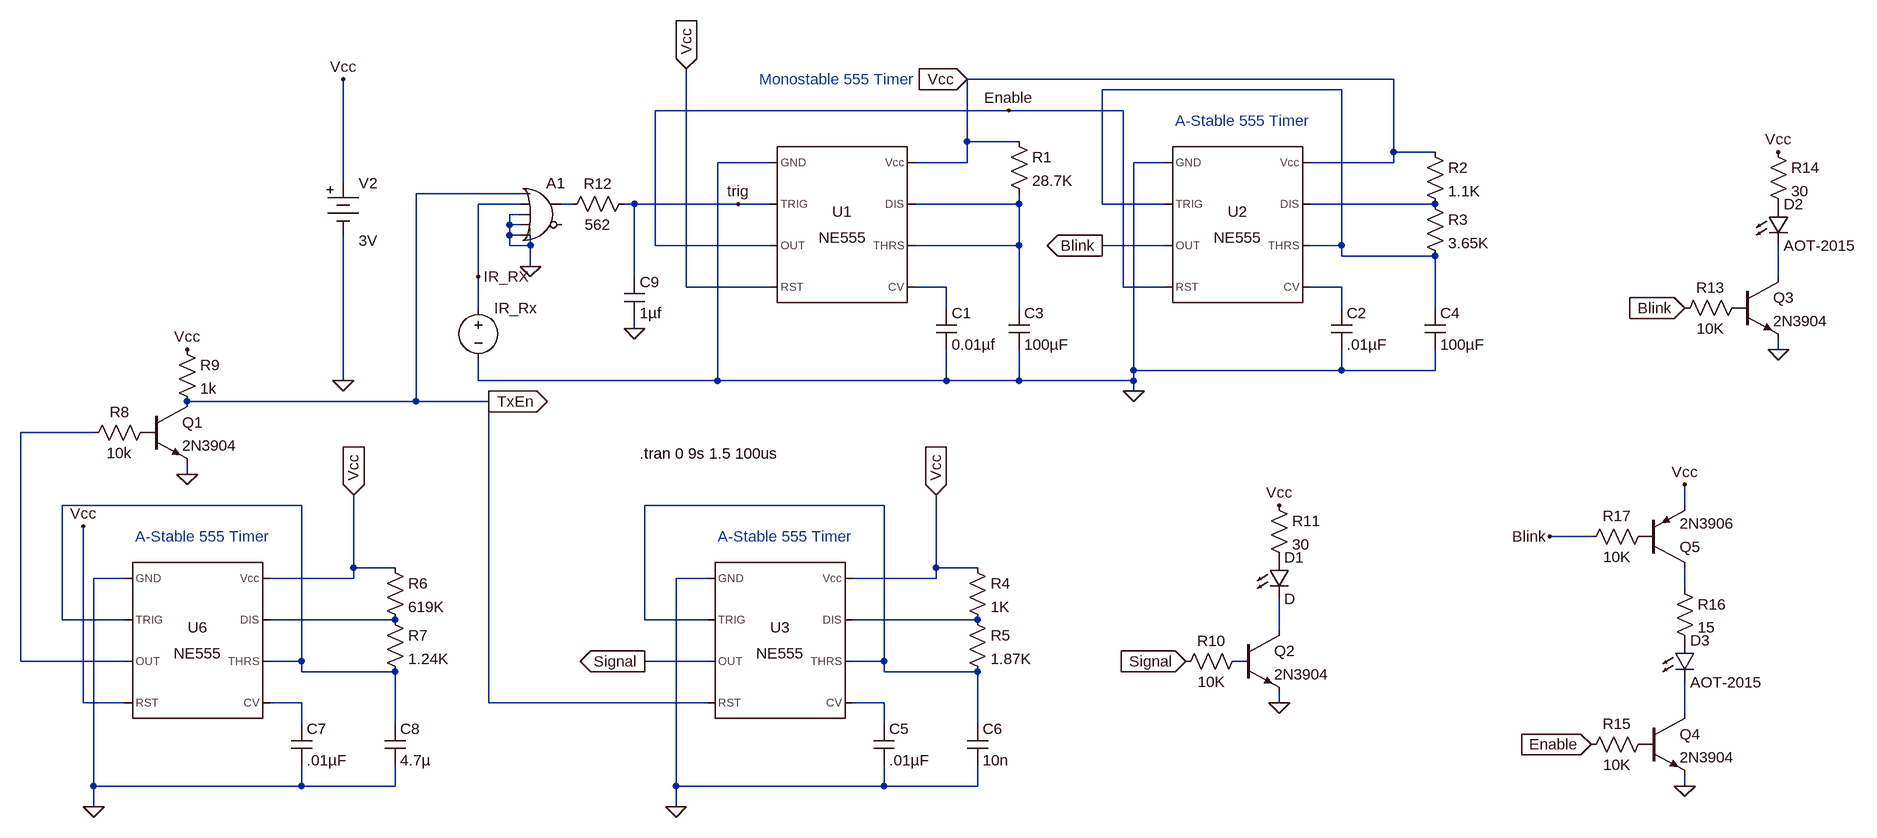
[diagram p0: schematic 555TimerPlanChris.asc]
555TimerPlanChris.asc, the LTspice schematic file:
Version 4
SHEET 1 1900 1200
WIRE 1184 64 528 64
WIRE 1104 80 736 80
WIRE 592 112 48 112
WIRE 768 112 592 112
WIRE 528 160 528 64
WIRE 608 160 528 160
WIRE 1184 176 1184 64
WIRE 1248 176 1184 176
WIRE 224 192 144 192
WIRE 528 192 528 160
WIRE 528 192 448 192
WIRE 832 192 784 192
WIRE 1184 192 1184 176
WIRE 1184 192 1056 192
WIRE -432 224 -432 64
WIRE -160 240 -320 240
WIRE -160 256 -224 256
WIRE -80 256 -96 256
WIRE 16 256 0 256
WIRE 176 256 16 256
WIRE 224 256 176 256
WIRE 608 256 608 240
WIRE 608 256 448 256
WIRE 736 256 736 80
WIRE 832 256 736 256
WIRE 1248 256 1056 256
WIRE -160 272 -176 272
WIRE -176 288 -176 272
WIRE -160 288 -176 288
WIRE -176 304 -176 288
WIRE -160 304 -176 304
WIRE -176 320 -176 304
WIRE -144 320 -144 304
WIRE -144 320 -176 320
WIRE 48 320 48 112
WIRE 224 320 48 320
WIRE 608 320 608 256
WIRE 608 320 448 320
WIRE 832 320 736 320
WIRE 1104 320 1104 80
WIRE 1104 320 1056 320
WIRE 1104 336 1104 320
WIRE 1248 336 1104 336
WIRE -144 352 -144 320
WIRE -224 368 -224 256
WIRE 16 368 16 256
WIRE 1776 368 1776 320
WIRE 96 384 96 48
WIRE 224 384 96 384
WIRE 496 384 448 384
WIRE 768 384 768 112
WIRE 832 384 768 384
WIRE 1104 384 1056 384
WIRE -224 416 -224 368
WIRE 496 416 496 384
WIRE 608 416 608 320
WIRE 1104 416 1104 384
WIRE 1248 416 1248 336
WIRE 16 448 16 432
WIRE 1776 480 1776 464
WIRE 784 512 784 192
WIRE 1104 512 1104 480
WIRE 1104 512 784 512
WIRE 1248 512 1248 480
WIRE 1248 512 1104 512
WIRE -432 528 -432 304
WIRE -224 528 -224 496
WIRE 144 528 144 192
WIRE 144 528 -224 528
WIRE 496 528 496 480
WIRE 496 528 144 528
WIRE 608 528 608 480
WIRE 608 528 496 528
WIRE 784 528 784 512
WIRE 784 528 608 528
WIRE 784 544 784 528
WIRE -320 560 -320 240
WIRE -320 560 -672 560
WIRE -208 560 -320 560
WIRE -816 608 -928 608
WIRE -672 672 -672 656
WIRE -496 720 -864 720
WIRE 400 720 32 720
WIRE 1632 720 1632 688
WIRE 1488 768 1424 768
WIRE -416 816 -416 704
WIRE -352 816 -416 816
WIRE 480 816 480 704
WIRE 544 816 480 816
WIRE -768 832 -816 832
WIRE -416 832 -416 816
WIRE -416 832 -544 832
WIRE 128 832 80 832
WIRE 480 832 480 816
WIRE 480 832 352 832
WIRE 1632 848 1632 816
WIRE -864 896 -864 720
WIRE -768 896 -864 896
WIRE -352 896 -544 896
WIRE 32 896 32 720
WIRE 128 896 32 896
WIRE 544 896 352 896
WIRE 1008 912 1008 864
WIRE -928 960 -928 608
WIRE -768 960 -928 960
WIRE -496 960 -496 720
WIRE -496 960 -544 960
WIRE 128 960 32 960
WIRE 400 960 400 720
WIRE 400 960 352 960
WIRE -496 976 -496 960
WIRE -352 976 -496 976
WIRE 400 976 400 960
WIRE 544 976 400 976
WIRE -832 1024 -832 752
WIRE -768 1024 -832 1024
WIRE -496 1024 -544 1024
WIRE -208 1024 -208 560
WIRE 128 1024 -208 1024
WIRE 400 1024 352 1024
WIRE 1008 1024 1008 1008
WIRE 1632 1040 1632 992
WIRE -496 1056 -496 1024
WIRE -352 1056 -352 976
WIRE 400 1056 400 1024
WIRE 544 1056 544 976
WIRE -816 1152 -816 832
WIRE -496 1152 -496 1120
WIRE -496 1152 -816 1152
WIRE -352 1152 -352 1120
WIRE -352 1152 -496 1152
WIRE 80 1152 80 832
WIRE 400 1152 400 1120
WIRE 400 1152 80 1152
WIRE 544 1152 544 1120
WIRE 544 1152 400 1152
WIRE 1632 1152 1632 1136
WIRE -816 1184 -816 1152
WIRE 80 1184 80 1152
FLAG 528 64 Vcc
IOPIN 528 64 In
FLAG 784 544 0
FLAG -432 528 0
FLAG -432 64 Vcc
FLAG 736 320 Blink
IOPIN 736 320 Out
FLAG 80 1184 0
FLAG 32 960 Signal
IOPIN 32 960 Out
FLAG -816 1184 0
FLAG -832 752 Vcc
FLAG 480 704 Vcc
IOPIN 480 704 In
FLAG -416 704 Vcc
IOPIN -416 704 In
FLAG -672 672 0
FLAG -672 480 Vcc
FLAG 1008 1024 0
FLAG 1008 720 Vcc
FLAG 864 960 Signal
IOPIN 864 960 In
FLAG -208 560 TxEn
IOPIN -208 560 Out
FLAG 96 48 Vcc
IOPIN 96 48 In
FLAG -144 352 0
FLAG -224 368 IR_RX
FLAG 16 448 0
FLAG 176 256 trig
FLAG 1776 480 0
FLAG 1776 176 Vcc
FLAG 1632 416 Blink
IOPIN 1632 416 In
FLAG 1632 1152 0
FLAG 1488 1088 Enable
IOPIN 1488 1088 In
FLAG 592 112 Enable
FLAG 1632 688 Vcc
FLAG 1424 768 Blink
SYMBOL Misc/NE555 336 288 R0
SYMATTR InstName U1
SYMBOL Misc/NE555 944 288 R0
SYMATTR InstName U2
SYMBOL cap 480 416 R0
SYMATTR InstName C1
SYMATTR Value 0.01µf
SYMBOL cap 1088 416 R0
SYMATTR InstName C2
SYMATTR Value .01µF
SYMBOL cap 592 416 R0
SYMATTR InstName C3
SYMATTR Value 100µF
SYMBOL res 592 144 R0
WINDOW 0 36 40 Left 2
WINDOW 3 36 76 Left 2
SYMATTR InstName R1
SYMATTR Value 28.7K
SYMBOL res 1232 160 R0
WINDOW 0 36 40 Left 2
WINDOW 3 36 76 Left 2
SYMATTR InstName R2
SYMATTR Value 1.1K
SYMBOL res 1232 240 R0
WINDOW 0 36 40 Left 2
WINDOW 3 36 76 Left 2
SYMATTR InstName R3
SYMATTR Value 3.65K
SYMBOL cap 1232 416 R0
SYMATTR InstName C4
SYMATTR Value 100µF
SYMBOL voltage -224 400 R0
WINDOW 3 24 96 Invisible 2
SYMATTR Value PULSE(3 0 2.03673 10us 10us 4ms 2.04073 3)
SYMATTR InstName IR_Rx
SYMBOL Misc/battery -432 208 R0
WINDOW 0 24 16 Left 2
WINDOW 3 24 104 Left 2
SYMATTR InstName V2
SYMATTR Value 3V
SYMBOL Misc/NE555 240 928 R0
SYMATTR InstName U3
SYMBOL cap 384 1056 R0
SYMATTR InstName C5
SYMATTR Value .01µF
SYMBOL res 528 800 R0
WINDOW 0 36 40 Left 2
WINDOW 3 36 76 Left 2
SYMATTR InstName R4
SYMATTR Value 1K
SYMBOL res 528 880 R0
WINDOW 0 36 40 Left 2
WINDOW 3 36 76 Left 2
SYMATTR InstName R5
SYMATTR Value 1.87K
SYMBOL cap 528 1056 R0
SYMATTR InstName C6
SYMATTR Value 10n
SYMATTR SpiceLine Rser=32.3m Lser=0 mfg="KEMET" pn="C0201C103K9PAC" type="X5R"
SYMBOL Misc/NE555 -656 928 R0
SYMATTR InstName U6
SYMBOL cap -512 1056 R0
SYMATTR InstName C7
SYMATTR Value .01µF
SYMBOL res -368 800 R0
WINDOW 0 36 40 Left 2
WINDOW 3 36 76 Left 2
SYMATTR InstName R6
SYMATTR Value 619K
SYMBOL res -368 880 R0
WINDOW 0 36 40 Left 2
WINDOW 3 36 76 Left 2
SYMATTR InstName R7
SYMATTR Value 1.24K
SYMBOL cap -368 1056 R0
SYMATTR InstName C8
SYMATTR Value 4.7µ
SYMATTR SpiceLine V=X Rser=3m Lser=0 mfg="TDK" pn="C2012X5ROJ475M" type="X5R"
SYMBOL res -720 592 R90
WINDOW 0 0 56 VBottom 2
WINDOW 3 32 56 VTop 2
SYMATTR InstName R8
SYMATTR Value 10k
SYMBOL npn -736 560 R0
WINDOW 0 56 32 Left 2
WINDOW 3 56 68 Left 2
SYMATTR InstName Q1
SYMATTR Value 2N3904
SYMBOL res -688 464 R0
WINDOW 0 36 40 Left 2
WINDOW 3 36 76 Left 2
SYMATTR InstName R9
SYMATTR Value 1k
SYMBOL res 960 944 R90
WINDOW 0 0 56 VBottom 2
WINDOW 3 32 56 VTop 2
SYMATTR InstName R10
SYMATTR Value 10K
SYMBOL npn 944 912 R0
SYMATTR InstName Q2
SYMATTR Value 2N3904
SYMBOL res 992 704 R0
WINDOW 0 36 40 Left 2
WINDOW 3 36 76 Left 2
SYMATTR InstName R11
SYMATTR Value 30
SYMBOL LED 992 800 R0
SYMATTR InstName D1
SYMBOL Digital/or -128 208 R0
SYMATTR InstName A1
SYMATTR SpiceLine Vhigh = 3
SYMBOL res 16 240 R90
WINDOW 0 0 56 VBottom 2
WINDOW 3 32 56 VTop 2
SYMATTR InstName R12
SYMATTR Value 562
SYMBOL cap 0 368 R0
SYMATTR InstName C9
SYMATTR Value 1µf
SYMBOL res 1728 400 R90
WINDOW 0 0 56 VBottom 2
WINDOW 3 32 56 VTop 2
SYMATTR InstName R13
SYMATTR Value 10K
SYMBOL npn 1712 368 R0
SYMATTR InstName Q3
SYMATTR Value 2N3904
SYMBOL res 1760 160 R0
WINDOW 0 36 40 Left 2
WINDOW 3 36 76 Left 2
SYMATTR InstName R14
SYMATTR Value 30
SYMBOL LED 1760 256 R0
SYMATTR InstName D2
SYMATTR Value AOT-2015
SYMBOL res 1584 1072 R90
WINDOW 0 0 56 VBottom 2
WINDOW 3 32 56 VTop 2
SYMATTR InstName R15
SYMATTR Value 10K
SYMBOL res 1616 832 R0
WINDOW 0 36 40 Left 2
WINDOW 3 36 76 Left 2
SYMATTR InstName R16
SYMATTR Value 15
SYMBOL LED 1616 928 R0
SYMATTR InstName D3
SYMATTR Value AOT-2015
SYMBOL npn 1568 1040 R0
SYMATTR InstName Q4
SYMATTR Value 2N3904
SYMBOL pnp 1568 816 M180
SYMATTR InstName Q5
SYMATTR Value 2N3906
SYMBOL res 1584 752 R90
WINDOW 0 0 56 VBottom 2
WINDOW 3 32 56 VTop 2
SYMATTR InstName R17
SYMATTR Value 10K
TEXT 208 64 Left 2 ;Monostable 555 Timer
TEXT 848 128 Left 2 ;A-Stable 555 Timer
TEXT 24 640 Left 2 !.tran 0 9s 1.5 100us
TEXT 144 768 Left 2 ;A-Stable 555 Timer
TEXT -752 768 Left 2 ;A-Stable 555 Timer

The netlist it stands for:
* 555TimerPlanChris.asc
XU1 0 trig Enable Vcc N006 N003 N003 Vcc NE555  ; pins GND TRIG OUT RST CV THRS DIS Vcc
XU2 0 N001 Blink Enable N007 N001 N004 Vcc NE555  ; pins GND TRIG OUT RST CV THRS DIS Vcc
C1 N006 0 0.01µf
C2 N007 0 .01µF
C3 N003 0 100µF
R1 Vcc N003 28.7K
R2 Vcc N004 1.1K
R3 N004 N001 3.65K
C4 N001 0 100µF
V§IR_Rx IR_RX 0 PULSE(3 0 2.03673 10us 10us 4ms 2.04073 3)
V2 Vcc 0 3V
XU3 0 N010 Signal TxEn N016 N010 N013 Vcc NE555  ; pins GND TRIG OUT RST CV THRS DIS Vcc
C5 N016 0 .01µF
R4 Vcc N013 1K
R5 N013 N010 1.87K
C6 N010 0 10n Rser=32.3m Lser=0 mfg="KEMET" pn="C0201C103K9PAC" type="X5R"
XU6 0 N009 N008 Vcc N015 N009 N012 Vcc NE555  ; pins GND TRIG OUT RST CV THRS DIS Vcc
C7 N015 0 .01µF
R6 Vcc N012 619K
R7 N012 N009 1.24K
C8 N009 0 4.7µ V=X Rser=3m Lser=0 mfg="TDK" pn="C2012X5ROJ475M" type="X5R"
R8 P001 N008 10k
Q1 TxEn P001 0 0 2N3904
R9 Vcc TxEn 1k
R10 P002 Signal 10K
Q2 N014 P002 0 0 2N3904
R11 Vcc P003 30
D1 P003 N014 D
A1 TxEn IR_RX 0 0 0 0 N002 0 OR Vhigh = 3
R12 trig N002 562
C9 trig 0 1µf
R13 P004 Blink 10K
Q3 N005 P004 0 0 2N3904
R14 Vcc P005 30
D2 P005 N005 AOT-2015
R15 P006 Enable 10K
R16 N011 P007 15
D3 P007 N017 AOT-2015
Q4 N017 P006 0 0 2N3904
Q5 N011 P008 Vcc 0 2N3906
R17 P008 Blink 10K
.model D D
.lib standard.dio
.model NPN NPN
.model PNP PNP
.lib standard.bjt
* Monostable 555 Timer
* A-Stable 555 Timer
.tran 0 9s 1.5 100us
* A-Stable 555 Timer
* A-Stable 555 Timer
.lib NE555.sub
.backanno
.end